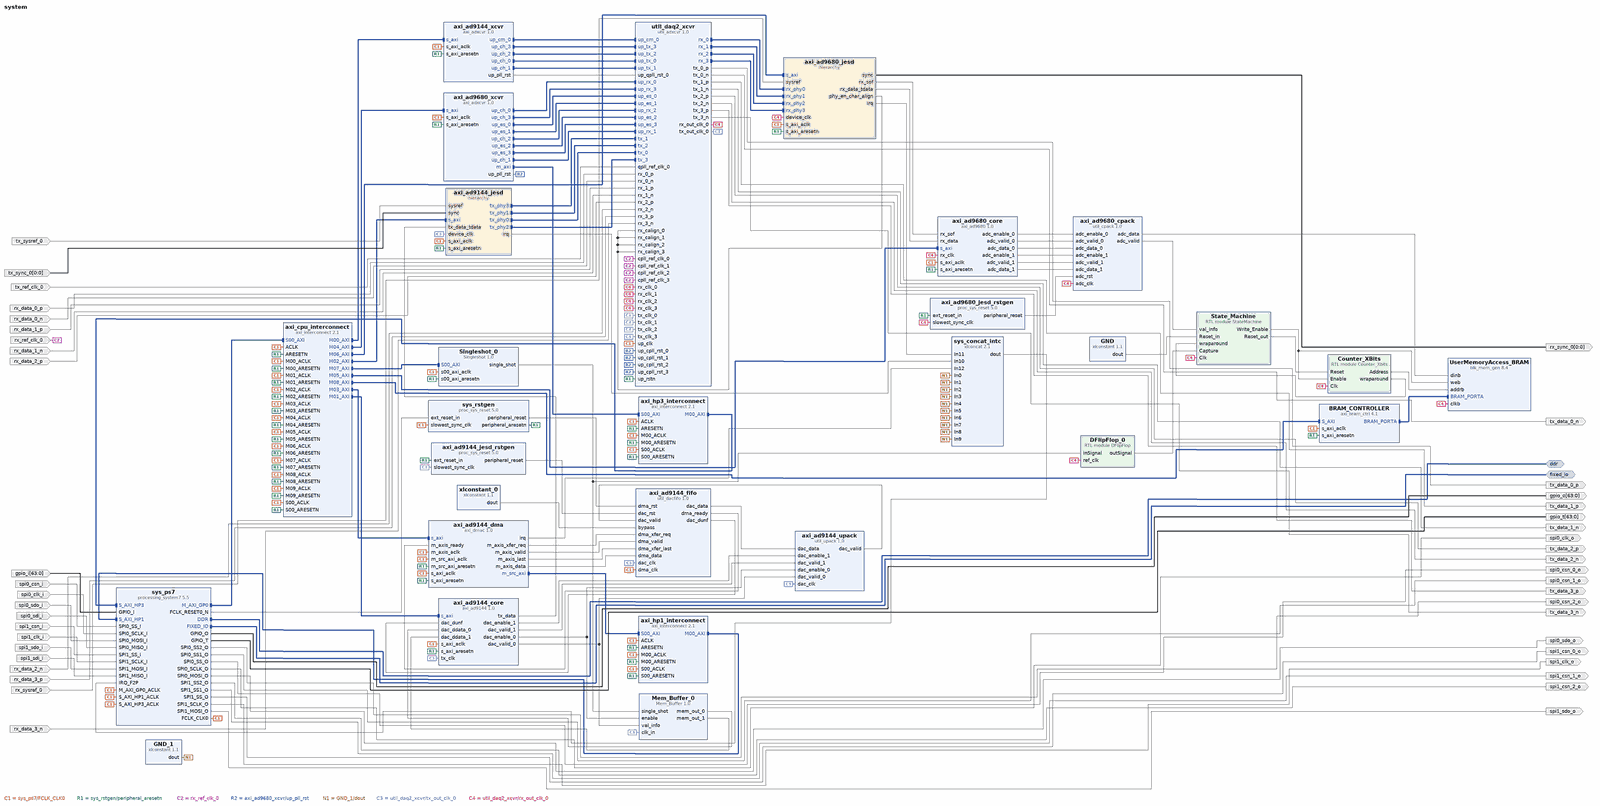
[diagram p0: block diagram of the top level, whole]
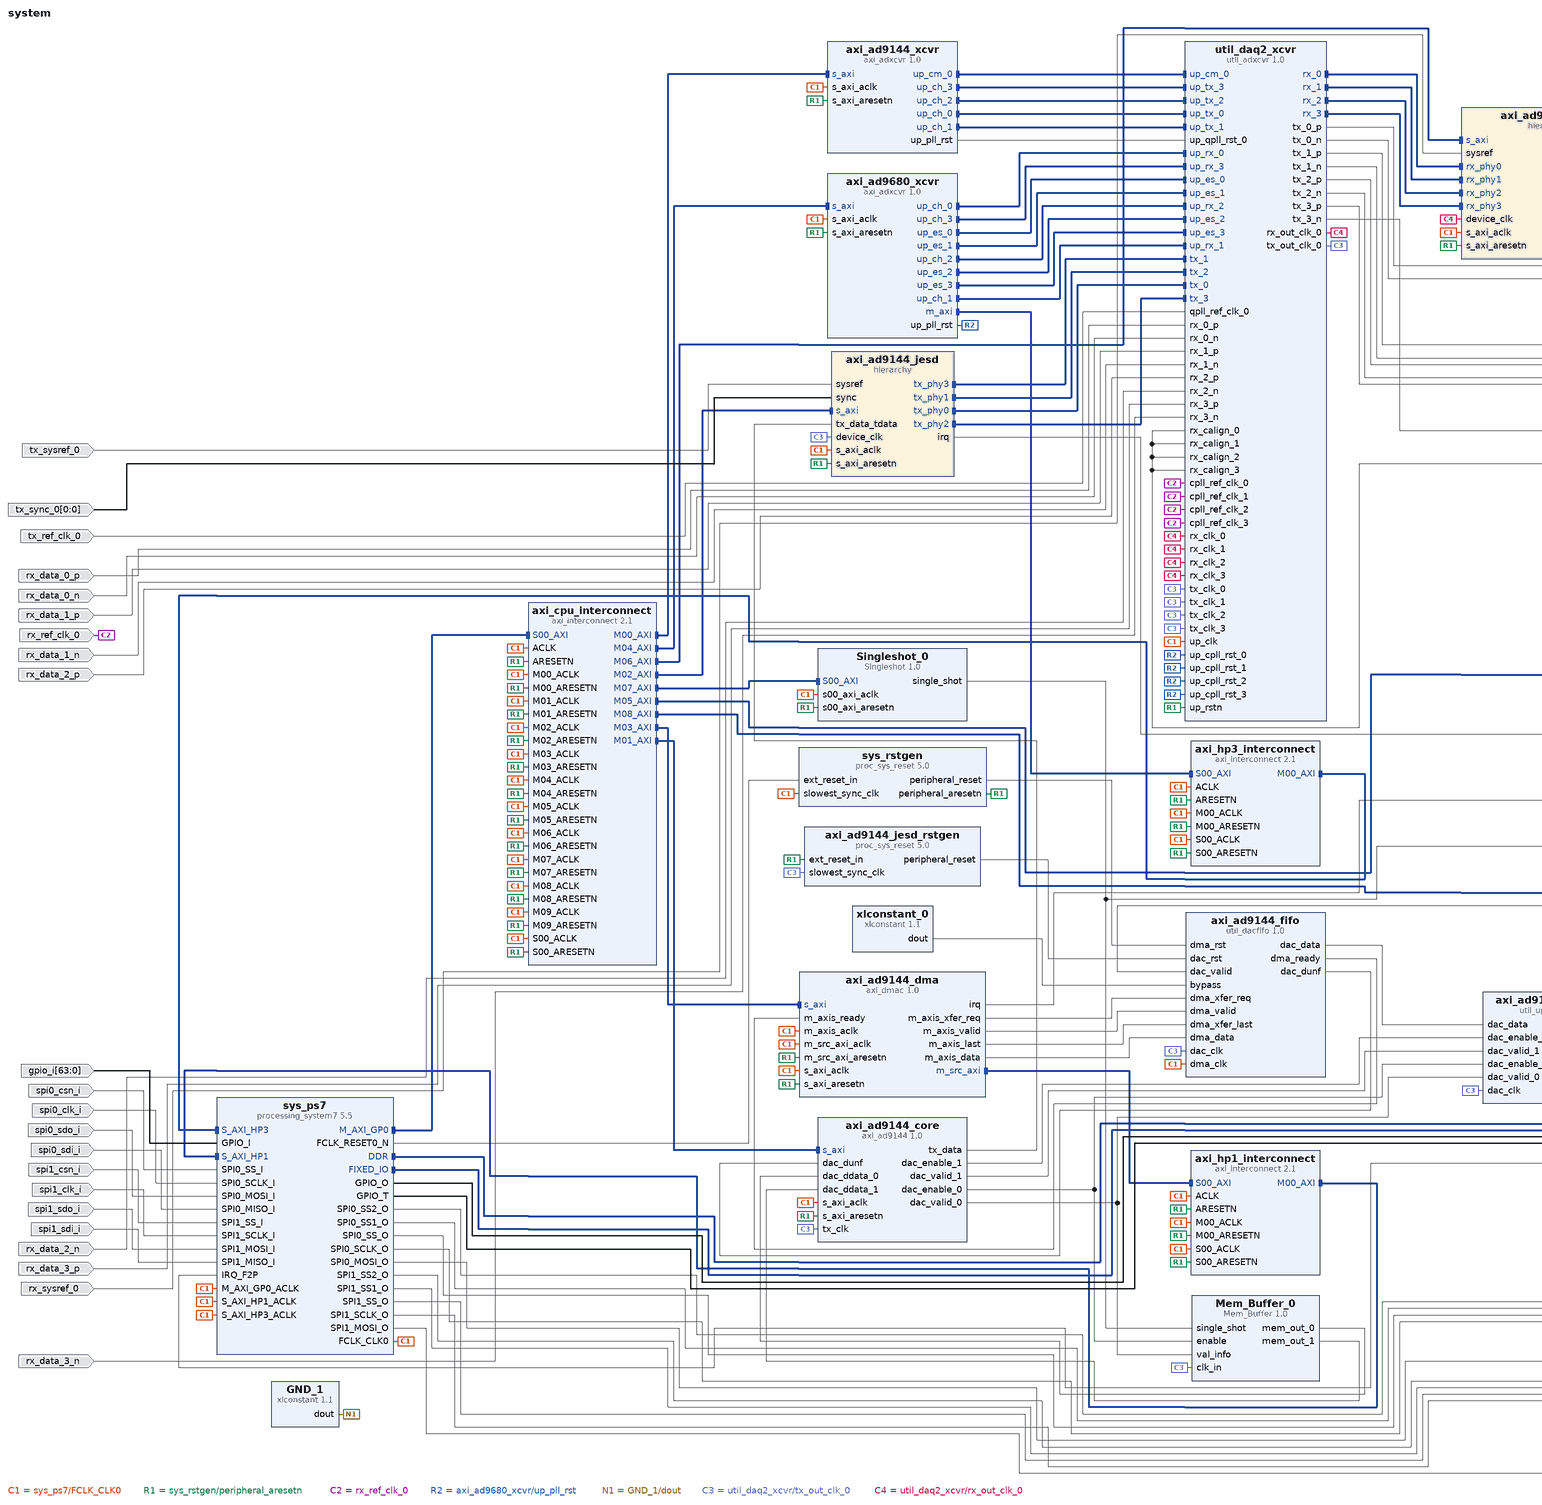
[diagram p1: block diagram of the top level, left part]
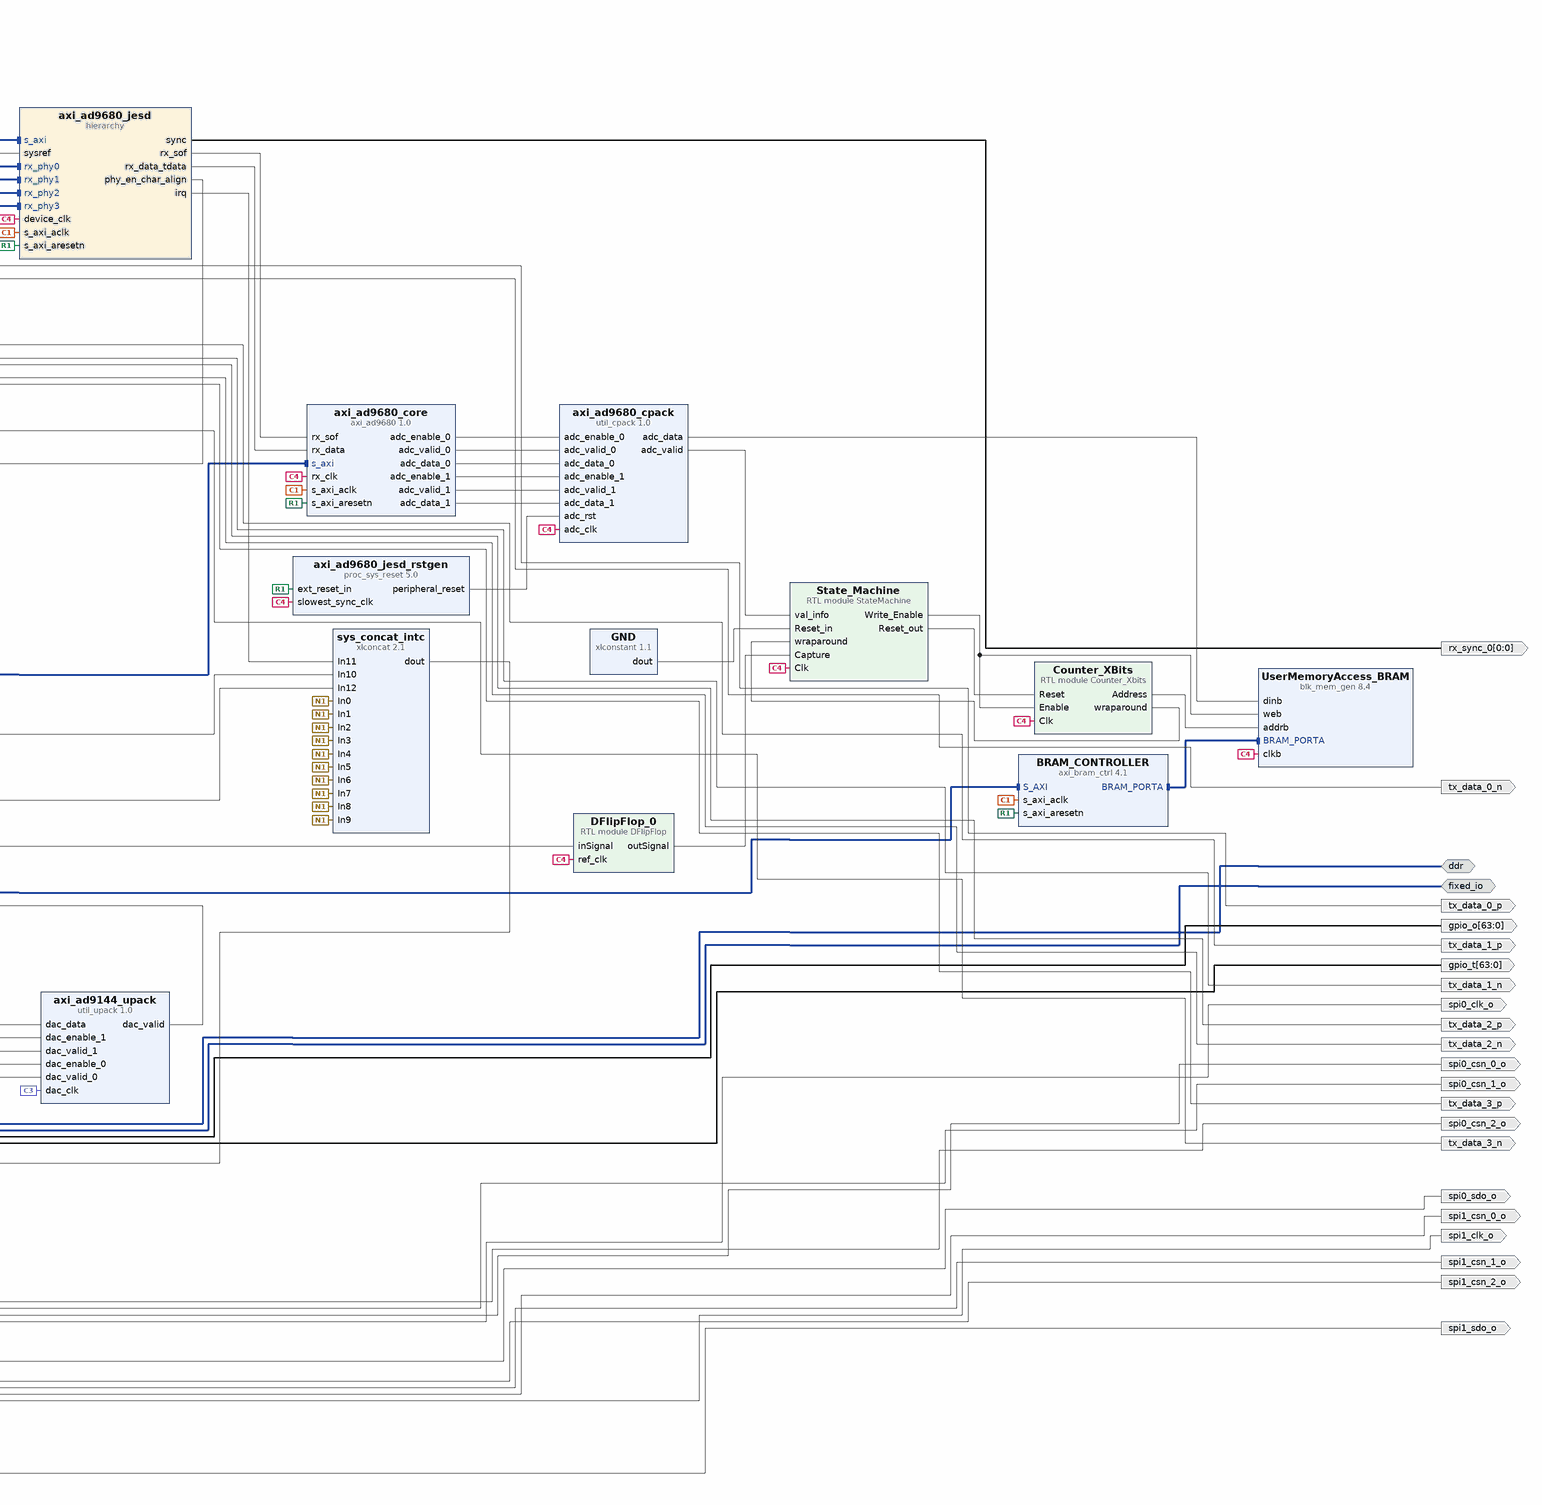
[diagram p2: block diagram of the top level, right part]
# Vivado block design system, xc7z045ffg900-2, Vivado 2018.3
create_bd_design system

create_bd_intf_port -mode Master -vlnv xilinx.com:interface:ddrx_rtl:1.0 ddr
create_bd_intf_port -mode Master -vlnv xilinx.com:display_processing_system7:fixedio_rtl:1.0 fixed_io
create_bd_port -dir O spi0_csn_2_o
create_bd_port -dir O spi0_csn_1_o
create_bd_port -dir O spi0_csn_0_o
create_bd_port -dir I spi0_csn_i
create_bd_port -dir I spi0_clk_i
create_bd_port -dir O spi0_clk_o
create_bd_port -dir I spi0_sdo_i
create_bd_port -dir O spi0_sdo_o
create_bd_port -dir I spi0_sdi_i
create_bd_port -dir O spi1_csn_2_o
create_bd_port -dir O spi1_csn_1_o
create_bd_port -dir O spi1_csn_0_o
create_bd_port -dir I spi1_csn_i
create_bd_port -dir I spi1_clk_i
create_bd_port -dir O spi1_clk_o
create_bd_port -dir I spi1_sdo_i
create_bd_port -dir O spi1_sdo_o
create_bd_port -dir I spi1_sdi_i
create_bd_port -dir I -from 63 -to 0 gpio_i
create_bd_port -dir O -from 63 -to 0 gpio_o
create_bd_port -dir O -from 63 -to 0 gpio_t
create_bd_port -dir I tx_ref_clk_0
create_bd_port -dir I rx_ref_clk_0
create_bd_port -dir I tx_sysref_0
create_bd_port -dir I -from 0 -to 0 tx_sync_0
create_bd_port -dir O tx_data_0_p
create_bd_port -dir O tx_data_0_n
create_bd_port -dir O tx_data_1_p
create_bd_port -dir O tx_data_1_n
create_bd_port -dir O tx_data_2_p
create_bd_port -dir O tx_data_2_n
create_bd_port -dir O tx_data_3_p
create_bd_port -dir O tx_data_3_n
create_bd_port -dir I rx_sysref_0
create_bd_port -dir O -from 0 -to 0 rx_sync_0
create_bd_port -dir I rx_data_0_p
create_bd_port -dir I rx_data_0_n
create_bd_port -dir I rx_data_1_p
create_bd_port -dir I rx_data_1_n
create_bd_port -dir I rx_data_2_p
create_bd_port -dir I rx_data_2_n
create_bd_port -dir I rx_data_3_p
create_bd_port -dir I rx_data_3_n

create_bd_cell -type ip -vlnv xilinx.com:ip:processing_system7:5.5 sys_ps7
set_property -dict [list \
  CONFIG.PCW_APU_PERIPHERAL_FREQMHZ 667.000000 \
  CONFIG.PCW_DUAL_PARALLEL_QSPI_DATA_MODE x8 \
  CONFIG.PCW_ENET0_ENET0_IO {MIO 16 .. 27} \
  CONFIG.PCW_ENET0_GRP_MDIO_ENABLE 1 \
  CONFIG.PCW_ENET0_GRP_MDIO_IO {MIO 52 .. 53} \
  CONFIG.PCW_ENET0_PERIPHERAL_ENABLE 1 \
  CONFIG.PCW_ENET0_PERIPHERAL_FREQMHZ {100 Mbps} \
  CONFIG.PCW_ENET0_RESET_ENABLE 1 \
  CONFIG.PCW_ENET0_RESET_IO {MIO 47} \
  CONFIG.PCW_ENET_RESET_ENABLE 1 \
  CONFIG.PCW_ENET_RESET_SELECT {Share reset pin} \
  CONFIG.PCW_FPGA0_PERIPHERAL_FREQMHZ 100.0 \
  CONFIG.PCW_FPGA1_PERIPHERAL_FREQMHZ 200.0 \
  CONFIG.PCW_GPIO_EMIO_GPIO_ENABLE 1 \
  CONFIG.PCW_GPIO_EMIO_GPIO_IO 64 \
  CONFIG.PCW_GPIO_MIO_GPIO_ENABLE 1 \
  CONFIG.PCW_GPIO_MIO_GPIO_IO MIO \
  CONFIG.PCW_I2C0_GRP_INT_ENABLE 0 \
  CONFIG.PCW_I2C0_I2C0_IO {MIO 50 .. 51} \
  CONFIG.PCW_I2C0_PERIPHERAL_ENABLE 1 \
  CONFIG.PCW_I2C0_RESET_ENABLE 1 \
  CONFIG.PCW_I2C0_RESET_IO {MIO 46} \
  CONFIG.PCW_I2C_PERIPHERAL_FREQMHZ 111.111115 \
  CONFIG.PCW_I2C_RESET_ENABLE 1 \
  CONFIG.PCW_I2C_RESET_SELECT {Share reset pin} \
  CONFIG.PCW_IRQ_F2P_INTR 1 \
  CONFIG.PCW_IRQ_F2P_MODE REVERSE \
  CONFIG.PCW_PRESET_BANK0_VOLTAGE {LVCMOS 1.8V} \
  CONFIG.PCW_PRESET_BANK1_VOLTAGE {LVCMOS 1.8V} \
  CONFIG.PCW_QSPI_GRP_FBCLK_ENABLE 1 \
  CONFIG.PCW_QSPI_GRP_FBCLK_IO {MIO 8} \
  CONFIG.PCW_QSPI_GRP_IO1_ENABLE 1 \
  CONFIG.PCW_QSPI_GRP_IO1_IO {MIO 0 9 .. 13} \
  CONFIG.PCW_QSPI_GRP_SINGLE_SS_ENABLE 0 \
  CONFIG.PCW_QSPI_INTERNAL_HIGHADDRESS 0xFDFFFFFF \
  CONFIG.PCW_QSPI_PERIPHERAL_ENABLE 1 \
  CONFIG.PCW_QSPI_QSPI_IO {MIO 1 .. 6} \
  CONFIG.PCW_SD0_GRP_CD_ENABLE 1 \
  CONFIG.PCW_SD0_GRP_CD_IO {MIO 14} \
  CONFIG.PCW_SD0_GRP_WP_ENABLE 1 \
  CONFIG.PCW_SD0_GRP_WP_IO {MIO 15} \
  CONFIG.PCW_SD0_PERIPHERAL_ENABLE 1 \
  CONFIG.PCW_SD0_SD0_IO {MIO 40 .. 45} \
  CONFIG.PCW_SDIO_PERIPHERAL_FREQMHZ 50 \
  CONFIG.PCW_SPI0_PERIPHERAL_ENABLE 1 \
  CONFIG.PCW_SPI0_SPI0_IO EMIO \
  CONFIG.PCW_SPI1_PERIPHERAL_ENABLE 1 \
  CONFIG.PCW_SPI1_SPI1_IO EMIO \
  CONFIG.PCW_UART1_PERIPHERAL_ENABLE 1 \
  CONFIG.PCW_UART1_UART1_IO {MIO 48 .. 49} \
  CONFIG.PCW_UART_PERIPHERAL_FREQMHZ 50 \
  CONFIG.PCW_UIPARAM_DDR_FREQ_MHZ 533.333313 \
  CONFIG.PCW_UIPARAM_DDR_PARTNO Custom \
  CONFIG.PCW_USB0_PERIPHERAL_ENABLE 0 \
  CONFIG.PCW_USB_RESET_ENABLE 1 \
  CONFIG.PCW_USE_FABRIC_INTERRUPT 1 \
  CONFIG.PCW_USE_S_AXI_HP1 1 \
  CONFIG.PCW_USE_S_AXI_HP3 1 \
  CONFIG.preset ZC706 \
] [get_bd_cells sys_ps7]
# 252 more settings of sys_ps7 are not shown: defaults, MIO pin electricals, DDR timing, and values the tool derives
create_bd_cell -type ip -vlnv xilinx.com:ip:xlconcat:2.1 sys_concat_intc
set_property -dict {CONFIG.NUM_PORTS 16} [get_bd_cells sys_concat_intc]
create_bd_cell -type ip -vlnv xilinx.com:ip:proc_sys_reset:5.0 sys_rstgen
set_property -dict {CONFIG.C_EXT_RST_WIDTH 1} [get_bd_cells sys_rstgen]
create_bd_cell -type ip -vlnv xilinx.com:ip:xlconstant:1.1 GND_1
set_property -dict {CONFIG.CONST_VAL 0 CONFIG.CONST_WIDTH 1} [get_bd_cells GND_1]
create_bd_cell -type ip -vlnv xilinx.com:ip:axi_interconnect:2.1 axi_cpu_interconnect
set_property -dict {CONFIG.NUM_MI 10} [get_bd_cells axi_cpu_interconnect]
create_bd_cell -type ip -vlnv analog.com:user:util_dacfifo:1.0 axi_ad9144_fifo
set_property -dict {CONFIG.ADDRESS_WIDTH 16 CONFIG.DATA_WIDTH 128} [get_bd_cells axi_ad9144_fifo]
create_bd_cell -type ip -vlnv analog.com:user:axi_adxcvr:1.0 axi_ad9144_xcvr
set_property -dict {CONFIG.NUM_OF_LANES 4 CONFIG.QPLL_ENABLE 1 CONFIG.TX_OR_RX_N 1} [get_bd_cells axi_ad9144_xcvr]
create_bd_cell -type hier axi_ad9144_jesd
create_bd_cell -type ip -vlnv analog.com:user:axi_ad9144:1.0 axi_ad9144_core
set_property -dict {CONFIG.QUAD_OR_DUAL_N 0} [get_bd_cells axi_ad9144_core]
create_bd_cell -type ip -vlnv analog.com:user:util_upack:1.0 axi_ad9144_upack
set_property -dict {CONFIG.CHANNEL_DATA_WIDTH 64 CONFIG.NUM_OF_CHANNELS 2} [get_bd_cells axi_ad9144_upack]
create_bd_cell -type ip -vlnv analog.com:user:axi_dmac:1.0 axi_ad9144_dma
set_property -dict [list \
  CONFIG.AXI_SLICE_DEST false \
  CONFIG.AXI_SLICE_SRC false \
  CONFIG.CYCLIC false \
  CONFIG.DMA_2D_TRANSFER false \
  CONFIG.DMA_DATA_WIDTH_DEST 128 \
  CONFIG.DMA_DATA_WIDTH_SRC 128 \
  CONFIG.DMA_LENGTH_WIDTH 24 \
  CONFIG.DMA_TYPE_DEST 1 \
  CONFIG.DMA_TYPE_SRC 0 \
  CONFIG.ID 1 \
] [get_bd_cells axi_ad9144_dma]
create_bd_cell -type ip -vlnv analog.com:user:axi_adxcvr:1.0 axi_ad9680_xcvr
set_property -dict {CONFIG.NUM_OF_LANES 4 CONFIG.QPLL_ENABLE 0 CONFIG.TX_OR_RX_N 0} [get_bd_cells axi_ad9680_xcvr]
create_bd_cell -type hier axi_ad9680_jesd
create_bd_cell -type ip -vlnv analog.com:user:axi_ad9680:1.0 axi_ad9680_core
create_bd_cell -type ip -vlnv analog.com:user:util_cpack:1.0 axi_ad9680_cpack
set_property -dict {CONFIG.CHANNEL_DATA_WIDTH 64 CONFIG.NUM_OF_CHANNELS 2} [get_bd_cells axi_ad9680_cpack]
create_bd_cell -type ip -vlnv analog.com:user:util_adxcvr:1.0 util_daq2_xcvr
set_property -dict [list \
  CONFIG.QPLL_FBDIV 0x030 \
  CONFIG.QPLL_FBDIV_RATIO 1 \
  CONFIG.QPLL_REFCLK_DIV 1 \
  CONFIG.RX_CDR_CFG 0x0B000023FF10400020 \
  CONFIG.RX_DFE_LPM_CFG 0x0104 \
  CONFIG.RX_NUM_OF_LANES 4 \
  CONFIG.RX_OUT_DIV 1 \
  CONFIG.TX_NUM_OF_LANES 4 \
  CONFIG.TX_OUT_DIV 1 \
] [get_bd_cells util_daq2_xcvr]
create_bd_cell -type ip -vlnv xilinx.com:ip:proc_sys_reset:5.0 axi_ad9144_jesd_rstgen
create_bd_cell -type ip -vlnv xilinx.com:ip:proc_sys_reset:5.0 axi_ad9680_jesd_rstgen
create_bd_cell -type ip -vlnv xilinx.com:ip:axi_interconnect:2.1 axi_hp3_interconnect
set_property -dict {CONFIG.NUM_MI 1 CONFIG.NUM_SI 1} [get_bd_cells axi_hp3_interconnect]
create_bd_cell -type ip -vlnv xilinx.com:ip:axi_interconnect:2.1 axi_hp1_interconnect
set_property -dict {CONFIG.NUM_MI 1 CONFIG.NUM_SI 1} [get_bd_cells axi_hp1_interconnect]
create_bd_cell -type ip -vlnv xilinx.com:ip:xlconstant:1.1 xlconstant_0
create_bd_cell -type ip -vlnv xilinx.com:user:Singleshot:1.0 Singleshot_0
create_bd_cell -type ip -vlnv xilinx.com:user:Mem_Buffer:1.0 Mem_Buffer_0
create_bd_cell -type module -reference DFlipFlop DFlipFlop_0
create_bd_cell -type ip -vlnv xilinx.com:ip:xlconstant:1.1 GND
set_property -dict {CONFIG.CONST_VAL 0} [get_bd_cells GND]
create_bd_cell -type module -reference Counter_Xbits Counter_XBits
create_bd_cell -type module -reference StateMachine State_Machine
create_bd_cell -type ip -vlnv xilinx.com:ip:blk_mem_gen:8.4 UserMemoryAccess_BRAM
set_property -dict [list \
  CONFIG.Assume_Synchronous_Clk false \
  CONFIG.Enable_32bit_Address false \
  CONFIG.Enable_A Use_ENA_Pin \
  CONFIG.Enable_B Always_Enabled \
  CONFIG.Memory_Type True_Dual_Port_RAM \
  CONFIG.Operating_Mode_A READ_FIRST \
  CONFIG.Port_B_Clock 100 \
  CONFIG.Port_B_Enable_Rate 100 \
  CONFIG.Port_B_Write_Rate 50 \
  CONFIG.Read_Width_B 128 \
  CONFIG.Register_PortA_Output_of_Memory_Primitives true \
  CONFIG.Register_PortB_Output_of_Memory_Primitives false \
  CONFIG.Use_Byte_Write_Enable false \
  CONFIG.Use_RSTA_Pin false \
  CONFIG.Use_RSTB_Pin false \
  CONFIG.Write_Depth_A 16384 \
  CONFIG.Write_Width_B 128 \
  CONFIG.use_bram_block Stand_Alone \
] [get_bd_cells UserMemoryAccess_BRAM]
create_bd_cell -type ip -vlnv xilinx.com:ip:axi_bram_ctrl:4.1 BRAM_CONTROLLER
set_property -dict {CONFIG.SINGLE_PORT_BRAM 1} [get_bd_cells BRAM_CONTROLLER]

# ---- hierarchy /axi_ad9144_jesd ----
current_bd_instance /axi_ad9144_jesd
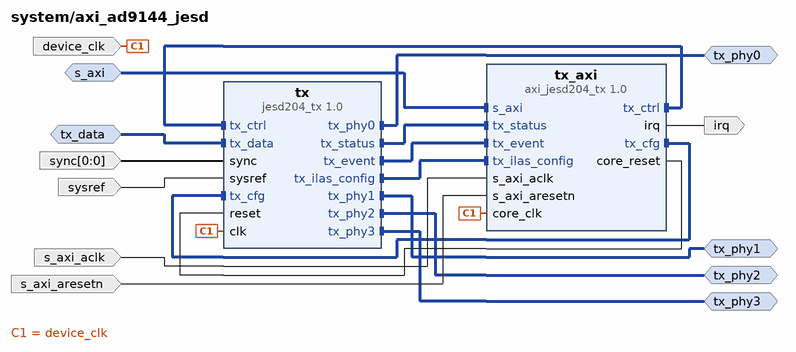
[diagram p3: block diagram inside /axi_ad9144_jesd]
create_bd_intf_pin -mode Slave -vlnv xilinx.com:interface:aximm_rtl:1.0 s_axi
create_bd_intf_pin -mode Slave -vlnv xilinx.com:interface:axis_rtl:1.0 tx_data
create_bd_intf_pin -mode Master -vlnv xilinx.com:display_jesd204:jesd204_tx_bus_rtl:1.0 tx_phy0
create_bd_intf_pin -mode Master -vlnv xilinx.com:display_jesd204:jesd204_tx_bus_rtl:1.0 tx_phy1
create_bd_intf_pin -mode Master -vlnv xilinx.com:display_jesd204:jesd204_tx_bus_rtl:1.0 tx_phy2
create_bd_intf_pin -mode Master -vlnv xilinx.com:display_jesd204:jesd204_tx_bus_rtl:1.0 tx_phy3
create_bd_pin -dir I -type clk s_axi_aclk
create_bd_pin -dir I -type rst s_axi_aresetn
create_bd_pin -dir O -type intr irq
create_bd_pin -dir I -type clk device_clk
create_bd_pin -dir I -from 0 -to 0 sync
create_bd_pin -dir I sysref

create_bd_cell -type ip -vlnv analog.com:user:axi_jesd204_tx:1.0 tx_axi
set_property -dict {CONFIG.NUM_LANES 4 CONFIG.NUM_LINKS 1} [get_bd_cells tx_axi]
create_bd_cell -type ip -vlnv analog.com:user:jesd204_tx:1.0 tx
set_property -dict {CONFIG.NUM_LANES 4 CONFIG.NUM_LINKS 1} [get_bd_cells tx]

# ---- hierarchy /axi_ad9680_jesd ----
current_bd_instance /axi_ad9680_jesd
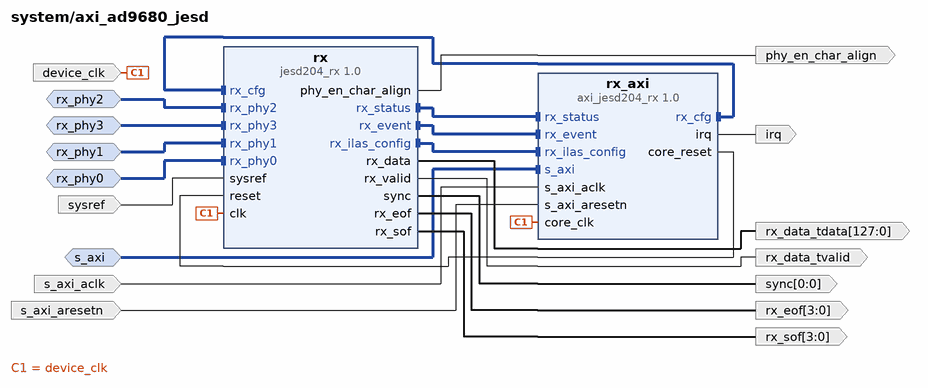
[diagram p4: block diagram inside /axi_ad9680_jesd]
create_bd_intf_pin -mode Slave -vlnv xilinx.com:interface:aximm_rtl:1.0 s_axi
create_bd_intf_pin -mode Slave -vlnv xilinx.com:display_jesd204:jesd204_rx_bus_rtl:1.0 rx_phy0
create_bd_intf_pin -mode Slave -vlnv xilinx.com:display_jesd204:jesd204_rx_bus_rtl:1.0 rx_phy1
create_bd_intf_pin -mode Slave -vlnv xilinx.com:display_jesd204:jesd204_rx_bus_rtl:1.0 rx_phy2
create_bd_intf_pin -mode Slave -vlnv xilinx.com:display_jesd204:jesd204_rx_bus_rtl:1.0 rx_phy3
create_bd_pin -dir I -type clk s_axi_aclk
create_bd_pin -dir I -type rst s_axi_aresetn
create_bd_pin -dir O -type intr irq
create_bd_pin -dir I -type clk device_clk
create_bd_pin -dir O -from 0 -to 0 sync
create_bd_pin -dir I sysref
create_bd_pin -dir O phy_en_char_align
create_bd_pin -dir O -from 3 -to 0 rx_eof
create_bd_pin -dir O -from 3 -to 0 rx_sof
create_bd_pin -dir O rx_data_tvalid
create_bd_pin -dir O -from 127 -to 0 rx_data_tdata

create_bd_cell -type ip -vlnv analog.com:user:axi_jesd204_rx:1.0 rx_axi
set_property -dict {CONFIG.NUM_LANES 4 CONFIG.NUM_LINKS 1} [get_bd_cells rx_axi]
create_bd_cell -type ip -vlnv analog.com:user:jesd204_rx:1.0 rx
set_property -dict {CONFIG.NUM_LANES 4 CONFIG.NUM_LINKS 1} [get_bd_cells rx]

# ---- connections ----

current_bd_instance /axi_ad9144_jesd
connect_bd_intf_net [get_bd_intf_pins tx_phy0] [get_bd_intf_pins tx/tx_phy0]
connect_bd_intf_net [get_bd_intf_pins s_axi] [get_bd_intf_pins tx_axi/s_axi]
connect_bd_intf_net [get_bd_intf_pins tx_phy3] [get_bd_intf_pins tx/tx_phy3]
connect_bd_intf_net [get_bd_intf_pins tx/tx_status] [get_bd_intf_pins tx_axi/tx_status]
connect_bd_intf_net [get_bd_intf_pins tx_data] [get_bd_intf_pins tx/tx_data]
connect_bd_intf_net [get_bd_intf_pins tx_phy2] [get_bd_intf_pins tx/tx_phy2]
connect_bd_intf_net [get_bd_intf_pins tx/tx_event] [get_bd_intf_pins tx_axi/tx_event]
connect_bd_intf_net [get_bd_intf_pins tx_axi/tx_ctrl] [get_bd_intf_pins tx/tx_ctrl]
connect_bd_intf_net [get_bd_intf_pins tx_axi/tx_cfg] [get_bd_intf_pins tx/tx_cfg]
connect_bd_intf_net [get_bd_intf_pins tx_phy1] [get_bd_intf_pins tx/tx_phy1]
connect_bd_intf_net [get_bd_intf_pins tx/tx_ilas_config] [get_bd_intf_pins tx_axi/tx_ilas_config]
connect_bd_net [get_bd_pins tx_axi/core_reset] [get_bd_pins tx/reset]
connect_bd_net [get_bd_pins s_axi_aclk] [get_bd_pins tx_axi/s_axi_aclk]
connect_bd_net [get_bd_pins s_axi_aresetn] [get_bd_pins tx_axi/s_axi_aresetn]
connect_bd_net [get_bd_pins tx_axi/irq] [get_bd_pins irq]
connect_bd_net [get_bd_pins device_clk] [get_bd_pins tx_axi/core_clk] [get_bd_pins tx/clk]
connect_bd_net [get_bd_pins sync] [get_bd_pins tx/sync]
connect_bd_net [get_bd_pins sysref] [get_bd_pins tx/sysref]

current_bd_instance /axi_ad9680_jesd
connect_bd_intf_net -intf_net rx_phy2_1 [get_bd_intf_pins rx_phy2] [get_bd_intf_pins rx/rx_phy2]
connect_bd_intf_net -intf_net rx_phy3_1 [get_bd_intf_pins rx_phy3] [get_bd_intf_pins rx/rx_phy3]
connect_bd_intf_net [get_bd_intf_pins s_axi] [get_bd_intf_pins rx_axi/s_axi]
connect_bd_intf_net [get_bd_intf_pins rx/rx_status] [get_bd_intf_pins rx_axi/rx_status]
connect_bd_intf_net [get_bd_intf_pins rx_axi/rx_cfg] [get_bd_intf_pins rx/rx_cfg]
connect_bd_intf_net [get_bd_intf_pins rx/rx_event] [get_bd_intf_pins rx_axi/rx_event]
connect_bd_intf_net -intf_net rx_phy1_1 [get_bd_intf_pins rx_phy1] [get_bd_intf_pins rx/rx_phy1]
connect_bd_intf_net [get_bd_intf_pins rx/rx_ilas_config] [get_bd_intf_pins rx_axi/rx_ilas_config]
connect_bd_intf_net -intf_net rx_phy0_1 [get_bd_intf_pins rx_phy0] [get_bd_intf_pins rx/rx_phy0]
connect_bd_net [get_bd_pins rx_axi/core_reset] [get_bd_pins rx/reset]
connect_bd_net [get_bd_pins s_axi_aclk] [get_bd_pins rx_axi/s_axi_aclk]
connect_bd_net [get_bd_pins s_axi_aresetn] [get_bd_pins rx_axi/s_axi_aresetn]
connect_bd_net [get_bd_pins rx_axi/irq] [get_bd_pins irq]
connect_bd_net [get_bd_pins device_clk] [get_bd_pins rx_axi/core_clk] [get_bd_pins rx/clk]
connect_bd_net [get_bd_pins rx/sync] [get_bd_pins sync]
connect_bd_net [get_bd_pins sysref] [get_bd_pins rx/sysref]
connect_bd_net [get_bd_pins rx/phy_en_char_align] [get_bd_pins phy_en_char_align]
connect_bd_net [get_bd_pins rx/rx_data] [get_bd_pins rx_data_tdata]
connect_bd_net [get_bd_pins rx/rx_valid] [get_bd_pins rx_data_tvalid]
connect_bd_net [get_bd_pins rx/rx_eof] [get_bd_pins rx_eof]
connect_bd_net [get_bd_pins rx/rx_sof] [get_bd_pins rx_sof]

current_bd_instance /
connect_bd_intf_net [get_bd_intf_pins util_daq2_xcvr/tx_1] [get_bd_intf_pins axi_ad9144_jesd/tx_phy3]
connect_bd_intf_net [get_bd_intf_pins util_daq2_xcvr/tx_2] [get_bd_intf_pins axi_ad9144_jesd/tx_phy1]
connect_bd_intf_net [get_bd_intf_pins axi_ad9680_xcvr/up_ch_0] [get_bd_intf_pins util_daq2_xcvr/up_rx_0]
connect_bd_intf_net [get_bd_intf_pins axi_ad9680_xcvr/up_ch_3] [get_bd_intf_pins util_daq2_xcvr/up_rx_3]
connect_bd_intf_net [get_bd_intf_pins axi_ad9680_xcvr/up_es_0] [get_bd_intf_pins util_daq2_xcvr/up_es_0]
connect_bd_intf_net [get_bd_intf_pins axi_hp3_interconnect/S00_AXI] [get_bd_intf_pins axi_ad9680_xcvr/m_axi]
connect_bd_intf_net [get_bd_intf_pins util_daq2_xcvr/rx_0] [get_bd_intf_pins axi_ad9680_jesd/rx_phy0]
connect_bd_intf_net [get_bd_intf_pins axi_ad9680_xcvr/up_es_1] [get_bd_intf_pins util_daq2_xcvr/up_es_1]
connect_bd_intf_net [get_bd_intf_pins axi_ad9144_xcvr/up_cm_0] [get_bd_intf_pins util_daq2_xcvr/up_cm_0]
connect_bd_intf_net [get_bd_intf_pins util_daq2_xcvr/rx_1] [get_bd_intf_pins axi_ad9680_jesd/rx_phy1]
connect_bd_intf_net -intf_net axi_bram_ctrl_0_BRAM_PORTA [get_bd_intf_pins BRAM_CONTROLLER/BRAM_PORTA] [get_bd_intf_pins UserMemoryAccess_BRAM/BRAM_PORTA]
connect_bd_intf_net [get_bd_intf_pins sys_ps7/S_AXI_HP3] [get_bd_intf_pins axi_hp3_interconnect/M00_AXI]
connect_bd_intf_net [get_bd_intf_pins axi_ad9144_xcvr/up_ch_3] [get_bd_intf_pins util_daq2_xcvr/up_tx_3]
connect_bd_intf_net [get_bd_intf_pins axi_cpu_interconnect/M00_AXI] [get_bd_intf_pins axi_ad9144_xcvr/s_axi]
connect_bd_intf_net [get_bd_intf_pins axi_cpu_interconnect/M06_AXI] [get_bd_intf_pins axi_ad9680_jesd/s_axi]
connect_bd_intf_net [get_bd_intf_ports ddr] [get_bd_intf_pins sys_ps7/DDR]
connect_bd_intf_net [get_bd_intf_pins util_daq2_xcvr/tx_0] [get_bd_intf_pins axi_ad9144_jesd/tx_phy0]
connect_bd_intf_net [get_bd_intf_pins util_daq2_xcvr/rx_2] [get_bd_intf_pins axi_ad9680_jesd/rx_phy2]
connect_bd_intf_net [get_bd_intf_pins axi_cpu_interconnect/M03_AXI] [get_bd_intf_pins axi_ad9144_dma/s_axi]
connect_bd_intf_net [get_bd_intf_pins sys_ps7/S_AXI_HP1] [get_bd_intf_pins axi_hp1_interconnect/M00_AXI]
connect_bd_intf_net [get_bd_intf_pins axi_cpu_interconnect/M02_AXI] [get_bd_intf_pins axi_ad9144_jesd/s_axi]
connect_bd_intf_net [get_bd_intf_pins axi_ad9680_xcvr/up_ch_2] [get_bd_intf_pins util_daq2_xcvr/up_rx_2]
connect_bd_intf_net [get_bd_intf_pins axi_cpu_interconnect/M01_AXI] [get_bd_intf_pins axi_ad9144_core/s_axi]
connect_bd_intf_net [get_bd_intf_pins axi_cpu_interconnect/M05_AXI] [get_bd_intf_pins axi_ad9680_core/s_axi]
connect_bd_intf_net [get_bd_intf_pins axi_ad9680_xcvr/up_es_2] [get_bd_intf_pins util_daq2_xcvr/up_es_2]
connect_bd_intf_net [get_bd_intf_pins axi_cpu_interconnect/M04_AXI] [get_bd_intf_pins axi_ad9680_xcvr/s_axi]
connect_bd_intf_net [get_bd_intf_pins axi_ad9144_xcvr/up_ch_2] [get_bd_intf_pins util_daq2_xcvr/up_tx_2]
connect_bd_intf_net [get_bd_intf_pins axi_cpu_interconnect/S00_AXI] [get_bd_intf_pins sys_ps7/M_AXI_GP0]
connect_bd_intf_net [get_bd_intf_pins axi_cpu_interconnect/M08_AXI] [get_bd_intf_pins BRAM_CONTROLLER/S_AXI]
connect_bd_intf_net [get_bd_intf_pins axi_hp1_interconnect/S00_AXI] [get_bd_intf_pins axi_ad9144_dma/m_src_axi]
connect_bd_intf_net [get_bd_intf_pins axi_ad9144_xcvr/up_ch_0] [get_bd_intf_pins util_daq2_xcvr/up_tx_0]
connect_bd_intf_net [get_bd_intf_pins util_daq2_xcvr/tx_3] [get_bd_intf_pins axi_ad9144_jesd/tx_phy2]
connect_bd_intf_net [get_bd_intf_pins util_daq2_xcvr/rx_3] [get_bd_intf_pins axi_ad9680_jesd/rx_phy3]
connect_bd_intf_net [get_bd_intf_pins axi_cpu_interconnect/M07_AXI] [get_bd_intf_pins Singleshot_0/S00_AXI]
connect_bd_intf_net [get_bd_intf_pins axi_ad9680_xcvr/up_es_3] [get_bd_intf_pins util_daq2_xcvr/up_es_3]
connect_bd_intf_net [get_bd_intf_ports fixed_io] [get_bd_intf_pins sys_ps7/FIXED_IO]
connect_bd_intf_net [get_bd_intf_pins axi_ad9144_xcvr/up_ch_1] [get_bd_intf_pins util_daq2_xcvr/up_tx_1]
connect_bd_intf_net [get_bd_intf_pins axi_ad9680_xcvr/up_ch_1] [get_bd_intf_pins util_daq2_xcvr/up_rx_1]
connect_bd_net -net sys_cpu_clk [get_bd_pins sys_ps7/FCLK_CLK0] \
  [get_bd_pins sys_rstgen/slowest_sync_clk] [get_bd_pins sys_ps7/M_AXI_GP0_ACLK] [get_bd_pins axi_cpu_interconnect/ACLK] \
  [get_bd_pins axi_cpu_interconnect/S00_ACLK] [get_bd_pins axi_cpu_interconnect/M00_ACLK] \
  [get_bd_pins axi_cpu_interconnect/M01_ACLK] [get_bd_pins axi_cpu_interconnect/M02_ACLK] \
  [get_bd_pins axi_cpu_interconnect/M03_ACLK] [get_bd_pins axi_cpu_interconnect/M04_ACLK] [get_bd_pins util_daq2_xcvr/up_clk] \
  [get_bd_pins axi_ad9144_fifo/dma_clk] [get_bd_pins axi_ad9144_dma/m_axis_aclk] [get_bd_pins axi_cpu_interconnect/M05_ACLK] \
  [get_bd_pins axi_ad9144_xcvr/s_axi_aclk] [get_bd_pins axi_cpu_interconnect/M06_ACLK] \
  [get_bd_pins axi_ad9144_core/s_axi_aclk] [get_bd_pins axi_cpu_interconnect/M07_ACLK] \
  [get_bd_pins axi_ad9144_jesd/s_axi_aclk] [get_bd_pins axi_cpu_interconnect/M08_ACLK] \
  [get_bd_pins axi_ad9144_dma/s_axi_aclk] [get_bd_pins axi_ad9680_xcvr/s_axi_aclk] [get_bd_pins axi_ad9680_core/s_axi_aclk] \
  [get_bd_pins axi_ad9680_jesd/s_axi_aclk] [get_bd_pins axi_hp3_interconnect/ACLK] \
  [get_bd_pins axi_hp3_interconnect/M00_ACLK] [get_bd_pins axi_hp3_interconnect/S00_ACLK] \
  [get_bd_pins axi_hp1_interconnect/ACLK] [get_bd_pins axi_hp1_interconnect/M00_ACLK] [get_bd_pins sys_ps7/S_AXI_HP1_ACLK] \
  [get_bd_pins axi_hp1_interconnect/S00_ACLK] [get_bd_pins axi_ad9144_dma/m_src_axi_aclk] \
  [get_bd_pins Singleshot_0/s00_axi_aclk] [get_bd_pins sys_ps7/S_AXI_HP3_ACLK] [get_bd_pins BRAM_CONTROLLER/s_axi_aclk] \
  [get_bd_pins axi_cpu_interconnect/M09_ACLK]
connect_bd_net -net sys_cpu_reset [get_bd_pins sys_rstgen/peripheral_reset] [get_bd_pins axi_ad9144_fifo/dma_rst]
connect_bd_net -net sys_cpu_resetn [get_bd_pins sys_rstgen/peripheral_aresetn] \
  [get_bd_pins axi_cpu_interconnect/ARESETN] [get_bd_pins axi_cpu_interconnect/S00_ARESETN] \
  [get_bd_pins axi_cpu_interconnect/M00_ARESETN] [get_bd_pins axi_cpu_interconnect/M01_ARESETN] \
  [get_bd_pins axi_cpu_interconnect/M02_ARESETN] [get_bd_pins axi_cpu_interconnect/M03_ARESETN] \
  [get_bd_pins axi_cpu_interconnect/M04_ARESETN] [get_bd_pins util_daq2_xcvr/up_rstn] \
  [get_bd_pins axi_ad9144_jesd_rstgen/ext_reset_in] [get_bd_pins axi_ad9144_dma/m_src_axi_aresetn] \
  [get_bd_pins axi_ad9680_jesd_rstgen/ext_reset_in] [get_bd_pins axi_cpu_interconnect/M05_ARESETN] \
  [get_bd_pins axi_ad9144_xcvr/s_axi_aresetn] [get_bd_pins axi_cpu_interconnect/M06_ARESETN] \
  [get_bd_pins axi_ad9144_core/s_axi_aresetn] [get_bd_pins axi_cpu_interconnect/M07_ARESETN] \
  [get_bd_pins axi_ad9144_jesd/s_axi_aresetn] [get_bd_pins axi_cpu_interconnect/M08_ARESETN] \
  [get_bd_pins axi_ad9144_dma/s_axi_aresetn] [get_bd_pins axi_ad9680_xcvr/s_axi_aresetn] \
  [get_bd_pins axi_ad9680_core/s_axi_aresetn] [get_bd_pins axi_ad9680_jesd/s_axi_aresetn] \
  [get_bd_pins axi_hp3_interconnect/ARESETN] [get_bd_pins axi_hp3_interconnect/M00_ARESETN] \
  [get_bd_pins axi_hp3_interconnect/S00_ARESETN] [get_bd_pins axi_hp1_interconnect/ARESETN] \
  [get_bd_pins axi_hp1_interconnect/M00_ARESETN] [get_bd_pins axi_hp1_interconnect/S00_ARESETN] \
  [get_bd_pins Singleshot_0/s00_axi_aresetn] [get_bd_pins BRAM_CONTROLLER/s_axi_aresetn] \
  [get_bd_pins axi_cpu_interconnect/M09_ARESETN]
connect_bd_net [get_bd_pins sys_ps7/FCLK_RESET0_N] [get_bd_pins sys_rstgen/ext_reset_in]
connect_bd_net [get_bd_ports gpio_i] [get_bd_pins sys_ps7/GPIO_I]
connect_bd_net [get_bd_pins sys_ps7/GPIO_O] [get_bd_ports gpio_o]
connect_bd_net [get_bd_pins sys_ps7/GPIO_T] [get_bd_ports gpio_t]
connect_bd_net [get_bd_pins sys_ps7/SPI0_SS2_O] [get_bd_ports spi0_csn_2_o]
connect_bd_net [get_bd_pins sys_ps7/SPI0_SS1_O] [get_bd_ports spi0_csn_1_o]
connect_bd_net [get_bd_pins sys_ps7/SPI0_SS_O] [get_bd_ports spi0_csn_0_o]
connect_bd_net [get_bd_ports spi0_csn_i] [get_bd_pins sys_ps7/SPI0_SS_I]
connect_bd_net [get_bd_ports spi0_clk_i] [get_bd_pins sys_ps7/SPI0_SCLK_I]
connect_bd_net [get_bd_pins sys_ps7/SPI0_SCLK_O] [get_bd_ports spi0_clk_o]
connect_bd_net [get_bd_ports spi0_sdo_i] [get_bd_pins sys_ps7/SPI0_MOSI_I]
connect_bd_net [get_bd_pins sys_ps7/SPI0_MOSI_O] [get_bd_ports spi0_sdo_o]
connect_bd_net [get_bd_ports spi0_sdi_i] [get_bd_pins sys_ps7/SPI0_MISO_I]
connect_bd_net [get_bd_pins sys_ps7/SPI1_SS2_O] [get_bd_ports spi1_csn_2_o]
connect_bd_net [get_bd_pins sys_ps7/SPI1_SS1_O] [get_bd_ports spi1_csn_1_o]
connect_bd_net [get_bd_pins sys_ps7/SPI1_SS_O] [get_bd_ports spi1_csn_0_o]
connect_bd_net [get_bd_ports spi1_csn_i] [get_bd_pins sys_ps7/SPI1_SS_I]
connect_bd_net [get_bd_ports spi1_clk_i] [get_bd_pins sys_ps7/SPI1_SCLK_I]
connect_bd_net [get_bd_pins sys_ps7/SPI1_SCLK_O] [get_bd_ports spi1_clk_o]
connect_bd_net [get_bd_ports spi1_sdo_i] [get_bd_pins sys_ps7/SPI1_MOSI_I]
connect_bd_net [get_bd_pins sys_ps7/SPI1_MOSI_O] [get_bd_ports spi1_sdo_o]
connect_bd_net [get_bd_ports spi1_sdi_i] [get_bd_pins sys_ps7/SPI1_MISO_I]
connect_bd_net [get_bd_pins sys_concat_intc/dout] [get_bd_pins sys_ps7/IRQ_F2P]
connect_bd_net -net tx_ref_clk_0_1 [get_bd_ports tx_ref_clk_0] [get_bd_pins util_daq2_xcvr/qpll_ref_clk_0]
connect_bd_net -net rx_ref_clk_0_1 [get_bd_ports rx_ref_clk_0] \
  [get_bd_pins util_daq2_xcvr/cpll_ref_clk_0] [get_bd_pins util_daq2_xcvr/cpll_ref_clk_1] \
  [get_bd_pins util_daq2_xcvr/cpll_ref_clk_2] [get_bd_pins util_daq2_xcvr/cpll_ref_clk_3]
connect_bd_net [get_bd_pins axi_ad9144_xcvr/up_pll_rst] [get_bd_pins util_daq2_xcvr/up_qpll_rst_0]
connect_bd_net [get_bd_pins axi_ad9680_xcvr/up_pll_rst] \
  [get_bd_pins util_daq2_xcvr/up_cpll_rst_0] [get_bd_pins util_daq2_xcvr/up_cpll_rst_1] \
  [get_bd_pins util_daq2_xcvr/up_cpll_rst_2] [get_bd_pins util_daq2_xcvr/up_cpll_rst_3]
connect_bd_net [get_bd_pins util_daq2_xcvr/tx_0_p] [get_bd_ports tx_data_0_p]
connect_bd_net [get_bd_pins util_daq2_xcvr/tx_0_n] [get_bd_ports tx_data_0_n]
connect_bd_net [get_bd_pins util_daq2_xcvr/tx_1_p] [get_bd_ports tx_data_1_p]
connect_bd_net [get_bd_pins util_daq2_xcvr/tx_1_n] [get_bd_ports tx_data_1_n]
connect_bd_net [get_bd_pins util_daq2_xcvr/tx_2_p] [get_bd_ports tx_data_2_p]
connect_bd_net [get_bd_pins util_daq2_xcvr/tx_2_n] [get_bd_ports tx_data_2_n]
connect_bd_net [get_bd_pins util_daq2_xcvr/tx_3_p] [get_bd_ports tx_data_3_p]
connect_bd_net [get_bd_pins util_daq2_xcvr/tx_3_n] [get_bd_ports tx_data_3_n]
connect_bd_net -net sysref_1 [get_bd_ports tx_sysref_0] [get_bd_pins axi_ad9144_jesd/sysref]
connect_bd_net -net sync_1 [get_bd_ports tx_sync_0] [get_bd_pins axi_ad9144_jesd/sync]
connect_bd_net -net tx_data_tdata_1 [get_bd_pins axi_ad9144_core/tx_data] [get_bd_pins axi_ad9144_jesd/tx_data_tdata]
connect_bd_net [get_bd_pins axi_ad9144_core/dac_enable_0] [get_bd_pins axi_ad9144_upack/dac_enable_0] [get_bd_pins Mem_Buffer_0/enable]
connect_bd_net [get_bd_pins axi_ad9144_core/dac_valid_0] [get_bd_pins axi_ad9144_upack/dac_valid_0] [get_bd_pins Mem_Buffer_0/val_info]
connect_bd_net [get_bd_pins axi_ad9144_core/dac_enable_1] [get_bd_pins axi_ad9144_upack/dac_enable_1]
connect_bd_net [get_bd_pins axi_ad9144_core/dac_valid_1] [get_bd_pins axi_ad9144_upack/dac_valid_1]
connect_bd_net [get_bd_pins axi_ad9144_jesd_rstgen/peripheral_reset] [get_bd_pins axi_ad9144_fifo/dac_rst]
connect_bd_net [get_bd_pins axi_ad9144_upack/dac_valid] [get_bd_pins axi_ad9144_fifo/dac_valid]
connect_bd_net [get_bd_pins axi_ad9144_fifo/dac_dunf] [get_bd_pins axi_ad9144_core/dac_dunf]
connect_bd_net [get_bd_pins axi_ad9144_dma/m_axis_xfer_req] [get_bd_pins axi_ad9144_fifo/dma_xfer_req]
connect_bd_net [get_bd_pins axi_ad9144_fifo/dma_ready] [get_bd_pins axi_ad9144_dma/m_axis_ready]
connect_bd_net [get_bd_pins axi_ad9144_dma/m_axis_valid] [get_bd_pins axi_ad9144_fifo/dma_valid]
connect_bd_net [get_bd_pins axi_ad9144_dma/m_axis_last] [get_bd_pins axi_ad9144_fifo/dma_xfer_last]
connect_bd_net [get_bd_pins axi_ad9680_jesd/phy_en_char_align] \
  [get_bd_pins util_daq2_xcvr/rx_calign_0] [get_bd_pins util_daq2_xcvr/rx_calign_1] [get_bd_pins util_daq2_xcvr/rx_calign_2] \
  [get_bd_pins util_daq2_xcvr/rx_calign_3]
connect_bd_net [get_bd_ports rx_data_0_p] [get_bd_pins util_daq2_xcvr/rx_0_p]
connect_bd_net [get_bd_ports rx_data_0_n] [get_bd_pins util_daq2_xcvr/rx_0_n]
connect_bd_net [get_bd_ports rx_data_1_p] [get_bd_pins util_daq2_xcvr/rx_1_p]
connect_bd_net [get_bd_ports rx_data_1_n] [get_bd_pins util_daq2_xcvr/rx_1_n]
connect_bd_net [get_bd_ports rx_data_2_p] [get_bd_pins util_daq2_xcvr/rx_2_p]
connect_bd_net [get_bd_ports rx_data_2_n] [get_bd_pins util_daq2_xcvr/rx_2_n]
connect_bd_net [get_bd_ports rx_data_3_p] [get_bd_pins util_daq2_xcvr/rx_3_p]
connect_bd_net [get_bd_ports rx_data_3_n] [get_bd_pins util_daq2_xcvr/rx_3_n]
connect_bd_net -net sysref_2 [get_bd_ports rx_sysref_0] [get_bd_pins axi_ad9680_jesd/sysref]
connect_bd_net [get_bd_pins axi_ad9680_jesd/sync] [get_bd_ports rx_sync_0]
connect_bd_net [get_bd_pins axi_ad9680_jesd/rx_sof] [get_bd_pins axi_ad9680_core/rx_sof]
connect_bd_net [get_bd_pins axi_ad9680_jesd/rx_data_tdata] [get_bd_pins axi_ad9680_core/rx_data]
connect_bd_net [get_bd_pins axi_ad9680_jesd_rstgen/peripheral_reset] [get_bd_pins axi_ad9680_cpack/adc_rst]
connect_bd_net [get_bd_pins axi_ad9680_core/adc_enable_0] [get_bd_pins axi_ad9680_cpack/adc_enable_0]
connect_bd_net [get_bd_pins axi_ad9680_core/adc_valid_0] [get_bd_pins axi_ad9680_cpack/adc_valid_0]
connect_bd_net [get_bd_pins axi_ad9680_core/adc_data_0] [get_bd_pins axi_ad9680_cpack/adc_data_0]
connect_bd_net [get_bd_pins axi_ad9680_core/adc_enable_1] [get_bd_pins axi_ad9680_cpack/adc_enable_1]
connect_bd_net [get_bd_pins axi_ad9680_core/adc_valid_1] [get_bd_pins axi_ad9680_cpack/adc_valid_1]
connect_bd_net [get_bd_pins axi_ad9680_core/adc_data_1] [get_bd_pins axi_ad9680_cpack/adc_data_1]
connect_bd_net [get_bd_pins axi_ad9680_cpack/adc_valid] [get_bd_pins State_Machine/val_info]
connect_bd_net [get_bd_pins axi_ad9680_cpack/adc_data] [get_bd_pins UserMemoryAccess_BRAM/dinb]
connect_bd_net [get_bd_pins axi_ad9144_jesd/irq] [get_bd_pins sys_concat_intc/In10]
connect_bd_net [get_bd_pins axi_ad9680_jesd/irq] [get_bd_pins sys_concat_intc/In11]
connect_bd_net [get_bd_pins axi_ad9144_dma/irq] [get_bd_pins sys_concat_intc/In12]
connect_bd_net [get_bd_pins GND_1/dout] \
  [get_bd_pins sys_concat_intc/In0] [get_bd_pins sys_concat_intc/In1] [get_bd_pins sys_concat_intc/In9] \
  [get_bd_pins sys_concat_intc/In8] [get_bd_pins sys_concat_intc/In6] [get_bd_pins sys_concat_intc/In7] \
  [get_bd_pins sys_concat_intc/In2] [get_bd_pins sys_concat_intc/In3] [get_bd_pins sys_concat_intc/In4] \
  [get_bd_pins sys_concat_intc/In5]
connect_bd_net [get_bd_pins xlconstant_0/dout] [get_bd_pins axi_ad9144_fifo/bypass]
connect_bd_net [get_bd_pins util_daq2_xcvr/tx_out_clk_0] \
  [get_bd_pins axi_ad9144_jesd_rstgen/slowest_sync_clk] [get_bd_pins util_daq2_xcvr/tx_clk_0] \
  [get_bd_pins util_daq2_xcvr/tx_clk_1] [get_bd_pins util_daq2_xcvr/tx_clk_2] [get_bd_pins util_daq2_xcvr/tx_clk_3] \
  [get_bd_pins axi_ad9144_jesd/device_clk] [get_bd_pins axi_ad9144_core/tx_clk] [get_bd_pins axi_ad9144_upack/dac_clk] \
  [get_bd_pins axi_ad9144_fifo/dac_clk] [get_bd_pins Mem_Buffer_0/clk_in]
connect_bd_net [get_bd_pins axi_ad9144_fifo/dac_data] [get_bd_pins axi_ad9144_upack/dac_data]
connect_bd_net [get_bd_pins axi_ad9144_dma/m_axis_data] [get_bd_pins axi_ad9144_fifo/dma_data]
connect_bd_net [get_bd_pins Mem_Buffer_0/mem_out_0] [get_bd_pins axi_ad9144_core/dac_ddata_0]
connect_bd_net [get_bd_pins Mem_Buffer_0/mem_out_1] [get_bd_pins axi_ad9144_core/dac_ddata_1]
connect_bd_net -net Singleshot_0_single_shot [get_bd_pins Singleshot_0/single_shot] \
  [get_bd_pins Mem_Buffer_0/single_shot] [get_bd_pins DFlipFlop_0/inSignal]
connect_bd_net [get_bd_pins util_daq2_xcvr/rx_out_clk_0] \
  [get_bd_pins axi_ad9680_jesd_rstgen/slowest_sync_clk] [get_bd_pins util_daq2_xcvr/rx_clk_0] \
  [get_bd_pins util_daq2_xcvr/rx_clk_1] [get_bd_pins util_daq2_xcvr/rx_clk_2] [get_bd_pins util_daq2_xcvr/rx_clk_3] \
  [get_bd_pins axi_ad9680_jesd/device_clk] [get_bd_pins axi_ad9680_core/rx_clk] [get_bd_pins axi_ad9680_cpack/adc_clk] \
  [get_bd_pins DFlipFlop_0/ref_clk] [get_bd_pins Counter_XBits/Clk] [get_bd_pins State_Machine/Clk] \
  [get_bd_pins UserMemoryAccess_BRAM/clkb]
connect_bd_net [get_bd_pins DFlipFlop_0/outSignal] [get_bd_pins State_Machine/Capture]
connect_bd_net -net StateMachine_0_Reset_out [get_bd_pins State_Machine/Reset_out] [get_bd_pins Counter_XBits/Reset]
connect_bd_net -net StateMachine_0_Write_Enable [get_bd_pins State_Machine/Write_Enable] \
  [get_bd_pins Counter_XBits/Enable] [get_bd_pins UserMemoryAccess_BRAM/web]
connect_bd_net -net Counter_Xbits_0_wraparound [get_bd_pins Counter_XBits/wraparound] [get_bd_pins State_Machine/wraparound]
connect_bd_net -net VCC_dout [get_bd_pins GND/dout] [get_bd_pins State_Machine/Reset_in]
connect_bd_net -net Counter_Xbits_0_Address [get_bd_pins Counter_XBits/Address] [get_bd_pins UserMemoryAccess_BRAM/addrb]
set_property HDL_ATTRIBUTE.BMM_INFO_PROCESSOR {arm > system BRAM_CONTROLLER} [get_bd_cells sys_ps7]
set_property HDL_ATTRIBUTE.KEEP_HIERARCHY yes [get_bd_cells sys_ps7]
set_property HDL_ATTRIBUTE.BMM_INFO_ADDRESS_SPACE {byte  0x40000000 32 > system UserMemoryAccess_BRAM} [get_bd_cells BRAM_CONTROLLER]
set_property HDL_ATTRIBUTE.KEEP_HIERARCHY yes [get_bd_cells BRAM_CONTROLLER]
set_property HDL_ATTRIBUTE.DEBUG true [get_bd_nets Singleshot_0_single_shot]
set_property HDL_ATTRIBUTE.MARK_DEBUG true [get_bd_nets Singleshot_0_single_shot]

# ---- address map ----
assign_bd_address -offset 0x00000000 -range 1G -target_address_space [get_bd_addr_spaces axi_ad9144_dma/m_src_axi] [get_bd_addr_segs sys_ps7/S_AXI_HP1/HP1_DDR_LOWOCM]
assign_bd_address -offset 0x00000000 -range 1G -target_address_space [get_bd_addr_spaces axi_ad9680_xcvr/m_axi] [get_bd_addr_segs sys_ps7/S_AXI_HP3/HP3_DDR_LOWOCM]
assign_bd_address -offset 0x40000000 -range 8K -target_address_space [get_bd_addr_spaces sys_ps7/Data] [get_bd_addr_segs BRAM_CONTROLLER/S_AXI/Mem0]
assign_bd_address -offset 0x43C00000 -range 4K -target_address_space [get_bd_addr_spaces sys_ps7/Data] [get_bd_addr_segs Singleshot_0/S00_AXI/S00_AXI_reg]
assign_bd_address -offset 0x44A00000 -range 64K -target_address_space [get_bd_addr_spaces sys_ps7/Data] [get_bd_addr_segs axi_ad9144_core/s_axi/axi_lite]
assign_bd_address -offset 0x44A10000 -range 64K -target_address_space [get_bd_addr_spaces sys_ps7/Data] [get_bd_addr_segs axi_ad9680_core/s_axi/axi_lite]
assign_bd_address -offset 0x44A50000 -range 64K -target_address_space [get_bd_addr_spaces sys_ps7/Data] [get_bd_addr_segs axi_ad9680_xcvr/s_axi/axi_lite]
assign_bd_address -offset 0x44A60000 -range 64K -target_address_space [get_bd_addr_spaces sys_ps7/Data] [get_bd_addr_segs axi_ad9144_xcvr/s_axi/axi_lite]
assign_bd_address -offset 0x44A90000 -range 16K -target_address_space [get_bd_addr_spaces sys_ps7/Data] [get_bd_addr_segs axi_ad9144_jesd/tx_axi/s_axi/axi_lite]
assign_bd_address -offset 0x44AA0000 -range 16K -target_address_space [get_bd_addr_spaces sys_ps7/Data] [get_bd_addr_segs axi_ad9680_jesd/rx_axi/s_axi/axi_lite]
assign_bd_address -offset 0x7C420000 -range 4K -target_address_space [get_bd_addr_spaces sys_ps7/Data] [get_bd_addr_segs axi_ad9144_dma/s_axi/axi_lite]

validate_bd_design
save_bd_design
